# Altium project two_ax_PCB.PrjPcb (part 1 of 2)
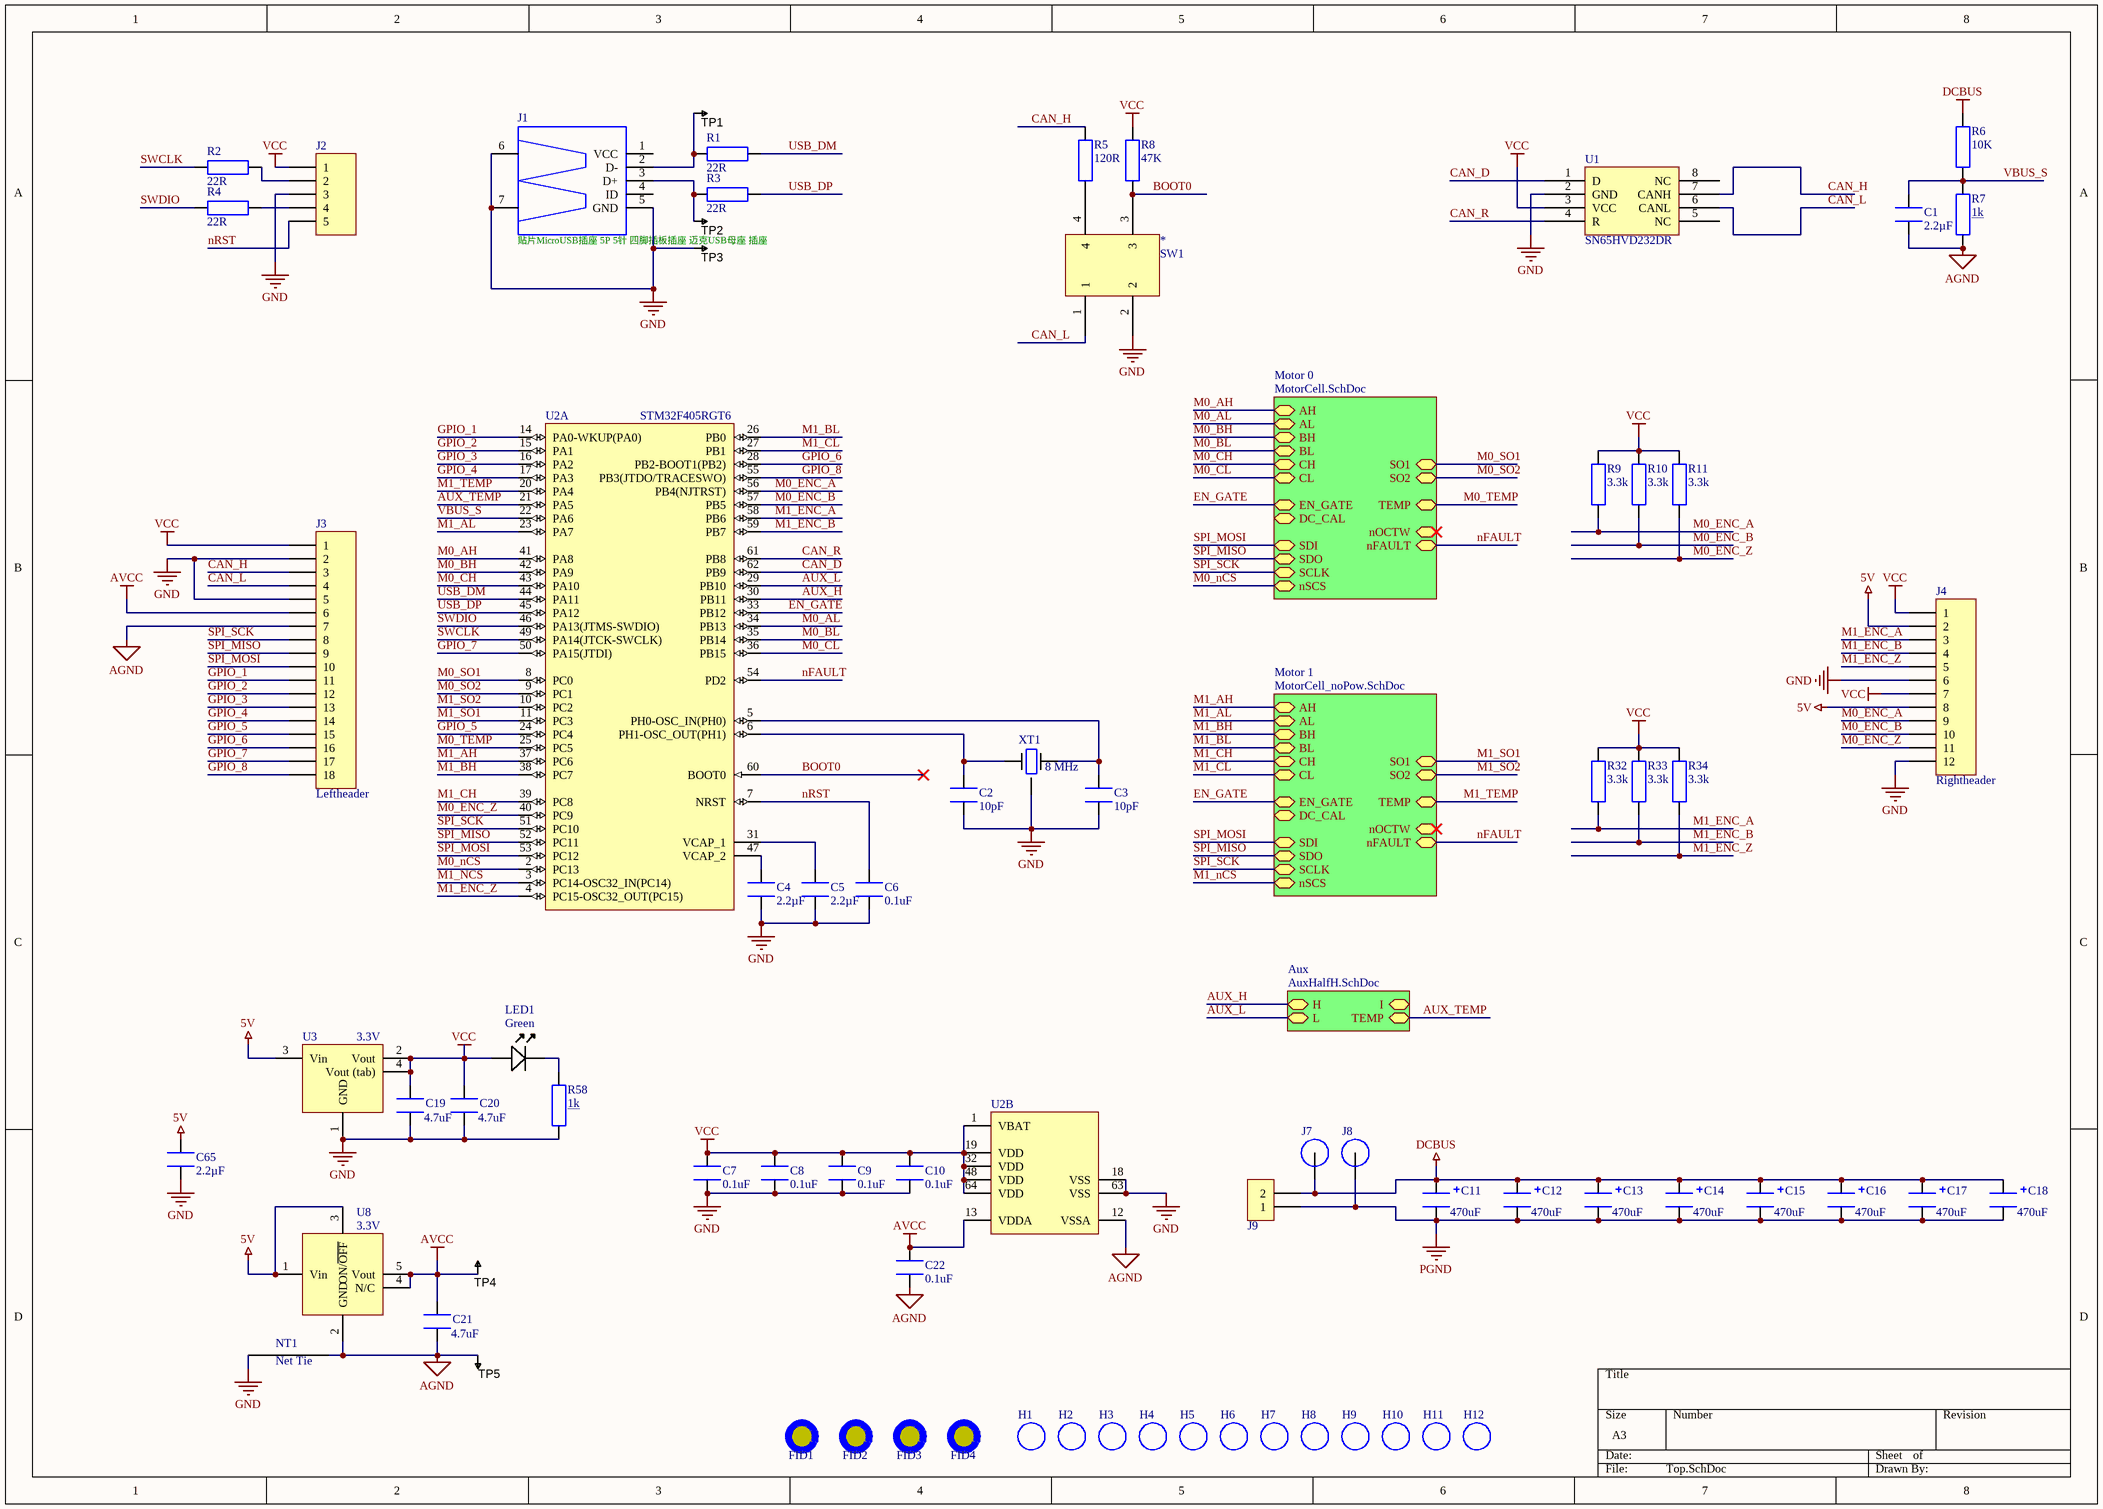
[diagram p0: Top.SchDoc]
3 sheets, 156 parts. Net scope: hierarchical (ports join the sheet entries above them; power ports are global).
Board file: PCB.PcbDoc
Sheets:
  Top.SchDoc
    Motor 0 = MotorCell.SchDoc
    Aux = AuxHalfH.SchDoc

## Sheet Top.SchDoc
size A3; SheetNumber: 1

### Parts
*  SW1  [switch_2]
C1  2.2µF  [CAPC1608X09L]
C2  10pF  [CAPC1608X09L]
C3  10pF  [CAPC1608X09L]
C4  2.2µF  [CAPC1608X09L]
C5  2.2µF  [CAPC1608X09L]
C6  0.1uF  [CAPC1608X09L]
C7  0.1uF  [CAPC1608X09L]
C8  0.1uF  [CAPC1608X09L]
C9  0.1uF  [CAPC1608X09L]
C10  0.1uF  [CAPC1608X09L]
C11  470uF  [CAP_ELEC_SIZE_G]
C12  470uF  [CAP_ELEC_SIZE_G]
C13  470uF  [CAP_ELEC_SIZE_G]
C14  470uF  [CAP_ELEC_SIZE_G]
C15  470uF  [CAP_ELEC_SIZE_G]
C16  470uF  [CAP_ELEC_SIZE_G]
C17  470uF  [CAP_ELEC_SIZE_G]
C18  470uF  [CAP_ELEC_SIZE_G]
C19  4.7uF  [CAPC2012X09N]
C20  4.7uF  [CAPC2012X09N]
C21  4.7uF  [CAPC2012X09N]
C22  0.1uF  [CAPC1608X09L]
C65  2.2µF  [CAPC1608X09L]
FID1  FIDUCIAL  [FIDUCIAL]  (value not drawn)
FID2  FIDUCIAL  [FIDUCIAL]  (value not drawn)
FID3  FIDUCIAL  [FIDUCIAL]  (value not drawn)
FID4  FIDUCIAL  [FIDUCIAL]  (value not drawn)
H1  (no value)  [M3 Hole]
H2  (no value)  [M3 Hole]
H3  (no value)  [M3 Hole]
H4  (no value)  [M3 Hole]
H5  (no value)  [M3 Hole]
H6  (no value)  [M3 Hole]
H7  (no value)  [M3 Hole]
H8  (no value)  [M3 Hole]
H9  (no value)  [M3 Hole]
H10  (no value)  [M3 Hole]
H11  (no value)  [M3 Hole]
H12  (no value)  [M3 Hole]
J1  贴片MicroUSB插座 5P 5针 四脚插板插座 迈克USB母座 插座  [Micro_USB]
J2  (no value)  [HDR1X5]
J3  Leftheader  [HDR1X18]
J4  Rightheader  [HDR1X12]
J7  (no value)  [M3 Spade Hole]
J8  (no value)  [M3 Spade Hole]
J9  1868076  [1868076]  (value not drawn)
LED1  Green  [LED-0603-GREEN]
NT1  (no value)  [NetTie_2mm]  (net tie, no BOM)
R1  22R  [RESC1608X55N]
R2  22R  [RESC1608X55N]
R3  22R  [RESC1608X55N]
R4  22R  [RESC1608X55N]
R5  120R  [RESC1608X55N]
R6  10K  [RESC1608X55N]
R7  1k  [RESC1608X55N]
R8  47K  [RESC1608X55N]
R9  3.3k  [RESC1608X55N]
R10  3.3k  [RESC1608X55N]
R11  3.3k  [RESC1608X55N]
R32  3.3k  [RESC1608X55N]
R33  3.3k  [RESC1608X55N]
R34  3.3k  [RESC1608X55N]
R58  1k  [RESC1608X55N]
TP1  TESTPOINT  [TP-R60]  (value not drawn)  (no BOM)
TP2  TESTPOINT  [TP-R60]  (value not drawn)  (no BOM)
TP3  TESTPOINT  [TP-R60]  (value not drawn)  (no BOM)
TP4  TESTPOINT  [TP-R30]  (value not drawn)  (no BOM)
TP5  TESTPOINT  [TP-R30]  (value not drawn)  (no BOM)
U1  Manufacturer Part Number: SN65HVD232DR  [SOIC127P600X175-8N]  (hidden comment: SN65HVD232D)
U2  (no value)  [STM-LQFP64_N]  (parts A,B of 2)
U3  3.3V  [SOT223]
U8  3.3V  [SOT23-5]
XT1  8 MHz  [DFN220P320X110-4N]

### Sub-sheets
Aux = AuxHalfH.SchDoc: H, L, I, TEMP
Motor 0 = MotorCell.SchDoc: nFAULT, nOCTW, EN_GATE, DC_CAL, SDI, SDO, SCLK, nSCS, SO1, SO2, AH, AL, BH, BL, CH, CL, TEMP
Motor 1 = MotorCell_noPow.SchDoc (file not in this document): nFAULT, nOCTW, EN_GATE, DC_CAL, SDI, SDO, SCLK, nSCS, SO1, SO2, AH, AL, BH, BL, CH, CL, TEMP

### Nets
5V: C65.2 J4.2 J4.8 U3.3(Vin) U8.1(Vin) U8.3(ON/~{OFF})
AGND: C1.1 C21.1 C22.2 J3.7 NT1.2 R7.1 TP5.1 U2.12(VSSA) U8.2(GND)
AVCC: C21.2 C22.1 J3.6 TP4.1 U2.13(VDDA) U8.4(N/C) U8.5(Vout)
DCBUS: C11.1 C12.1 C13.1 C14.1 C15.1 C16.1 C17.1 C18.1 J7.1 J9.2 R6.2
GND: *.2 C2.2 C3.2 C4.1 C5.1 C6.1 C7.2 C8.2 C9.2 C10.2 C19.1 C20.1 C65.1 J1.5(GND) J1.6 J1.7 J2.3 J3.2 J3.5 J4.6 J4.12 NT1.1 R58.2 TP3.1 U1.2(GND) U2.18(VSS) U2.63(VSS) U3.1(GND) XT1.G
PGND: C11.2 C12.2 C13.2 C14.2 C15.2 C16.2 C17.2 C18.2 J8.1 J9.1
VCC: C7.1 C8.1 C9.1 C10.1 C19.2 C20.2 J2.1 J3.1 J4.1 J4.7 LED1.A R8.2 R9.2 R10.2 R11.2 R32.1 R33.1 R34.1 U1.3(VCC) U2.1(VBAT) U2.19(VDD) U2.32(VDD) U2.48(VDD) U2.64(VDD) U3.2(Vout) U3.4(Vout_(tab))
AUX_H: U2.30(PB11) ; sheet Aux/H
AUX_L: U2.29(PB10) ; sheet Aux/L
AUX_TEMP: U2.21(PA5) ; sheet Aux/TEMP
BOOT0: *.3 R8.1 U2.60(BOOT0)  [project net BOOT0_1]
CAN_D: U1.1(D) U2.62(PB9)  [project net CAN_D_1]
CAN_H: J3.3 R5.2 U1.7(CANH)  [project net CAN_H_1]
CAN_L: *.1 J3.4 U1.6(CANL)  [project net CAN_L_1]
CAN_R: U1.4(R) U2.61(PB8)  [project net CAN_R_1]
EN_GATE: U2.33(PB12) ; sheet Motor 0/EN_GATE, sheet Motor 1/EN_GATE
GPIO_1: J3.11 U2.14(PA0-WKUP(PA0))  [project net GPIO_1_1]
GPIO_2: J3.12 U2.15(PA1)  [project net GPIO_2_1]
GPIO_3: J3.13 U2.16(PA2)  [project net GPIO_3_1]
GPIO_4: J3.14 U2.17(PA3)  [project net GPIO_4_1]
GPIO_5: J3.15 U2.24(PC4)  [project net GPIO_5_1]
GPIO_6: J3.16 U2.28(PB2-BOOT1(PB2))  [project net GPIO_6_1]
GPIO_7: J3.17 U2.50(PA15(JTDI))  [project net GPIO_7_1]
GPIO_8: J3.18 U2.55(PB3(JTDO/TRACESWO))  [project net GPIO_8_1]
M0_AH: U2.41(PA8) ; sheet Motor 0/AH
M0_AL: U2.34(PB13) ; sheet Motor 0/AL
M0_BH: U2.42(PA9) ; sheet Motor 0/BH
M0_BL: U2.35(PB14) ; sheet Motor 0/BL
M0_CH: U2.43(PA10) ; sheet Motor 0/CH
M0_CL: U2.36(PB15) ; sheet Motor 0/CL
M0_ENC_A: J4.9 R9.1 U2.56(PB4(NJTRST))  [project net M0_ENC_A_1]
M0_ENC_B: J4.10 R10.1 U2.57(PB5)  [project net M0_ENC_B_1]
M0_ENC_Z: J4.11 R11.1 U2.40(PC9)  [project net M0_ENC_Z_1]
M0_nCS: U2.2(PC13) ; sheet Motor 0/nSCS
M0_SO1: U2.8(PC0) ; sheet Motor 0/SO1
M0_SO2: U2.9(PC1) ; sheet Motor 0/SO2
M0_TEMP: U2.25(PC5) ; sheet Motor 0/TEMP
M1_AH: U2.37(PC6) ; sheet Motor 1/AH
M1_AL: U2.23(PA7) ; sheet Motor 1/AL
M1_BH: U2.38(PC7) ; sheet Motor 1/BH
M1_BL: U2.26(PB0) ; sheet Motor 1/BL
M1_CH: U2.39(PC8) ; sheet Motor 1/CH
M1_CL: U2.27(PB1) ; sheet Motor 1/CL
M1_ENC_A: J4.3 R32.2 U2.58(PB6)  [project net M1_ENC_A_1]
M1_ENC_B: J4.4 R33.2 U2.59(PB7)  [project net M1_ENC_B_1]
M1_ENC_Z: J4.5 R34.2 U2.4(PC15-OSC32_OUT(PC15))  [project net M1_ENC_Z_1]
M1_nCS: U2.3(PC14-OSC32_IN(PC14)) ; sheet Motor 1/nSCS
M1_SO1: U2.11(PC3) ; sheet Motor 1/SO1
M1_SO2: U2.10(PC2) ; sheet Motor 1/SO2
M1_TEMP: U2.20(PA4) ; sheet Motor 1/TEMP
nFAULT: U2.54(PD2) ; sheet Motor 0/nFAULT, sheet Motor 1/nFAULT
nRST: C6.2 J2.5 U2.7(NRST)  [project net nRST_1]
SPI_MISO: J3.9 U2.52(PC11) ; sheet Motor 0/SDO, sheet Motor 1/SDO
SPI_MOSI: J3.10 U2.53(PC12) ; sheet Motor 0/SDI, sheet Motor 1/SDI
SPI_SCK: J3.8 U2.51(PC10) ; sheet Motor 0/SCLK, sheet Motor 1/SCLK
SWCLK: R2.2 U2.49(PA14(JTCK-SWCLK))  [project net SWCLK_1]
SWDIO: R4.2 U2.46(PA13(JTMS-SWDIO))  [project net SWDIO_1]
USB_DM: R1.1 U2.44(PA11)  [project net USB_DM_1]
USB_DP: R3.1 U2.45(PA12)  [project net USB_DP_1]
VBUS_S: C1.2 R6.1 R7.2 U2.22(PA6)  [project net VBUS_S_1]
Net*_4: *.4 R5.1
NetC2_1: C2.1 U2.6(PH1-OSC_OUT(PH1)) XT1.1
NetC3_1: C3.1 U2.5(PH0-OSC_IN(PH0)) XT1.3
NetC4_2: C4.2 U2.47(VCAP_2)
NetC5_2: C5.2 U2.31(VCAP_1)
NetJ1_2: J1.2(D-) R1.2 TP1.1
NetJ1_3: J1.3(D+) R3.2 TP2.1
NetJ2_2: J2.2 R2.1
NetJ2_4: J2.4 R4.1
NetLED1_K: LED1.K R58.1

Not connected (* = marked no-connect by the designer): J1 1(VCC) 4(ID); U1 5(NC) 8(NC)

### Notes on the sheet
- (in symbol NetTie_2mm) Net Tie

### Library data of the parts
* = Switch_2
C1 C4 C5 C65 = GRM188R61C225KE15D: CAP CER 2.2UF 16V X5R 0603; Manufacturer: Murata Electronics North America; Tolerance: ?0%; Supplier 1: Digi-Key; Supplier Part Number 1: 490-3296-1-ND; Manufacturer Part Number: GRM188R61C225KE15D; RoHS: RoHS Compliant; Category: Capacitors; Stock 1: 1255740; Pricing 1: 1=0.12, 10=0.08, 50=0.046, 100=0.038, 250=0.032, 500=0.0268, 1000=0.022 (USD); Packaging: Cut Tape (CT); Capacitance: 2.2µF; Voltage - Rated: 16V; Temperature Coefficient: X5R; Mounting Type: Surface Mount, MLCC; Operating Temperature: -55°C ~ 85°C; Applications: General Purpose; Ratings: -; Package / Case: 0603 (1608 Metric); Size / Dimension: 0.063" L x 0.031" W (1.60mm x 0.80mm); Height - Seated (Max): -; Thickness (Max): 0.035" (0.90mm); Lead Spacing: -; Features: -; Lead Style: -; ComponentLink1URL: http://www.murata.com/~/media/webrenewal/support/library/catalog/products/capacitor/mlcc/c02e.pdf; ComponentLink1Description: http://www.murata.com/~/media/webrenewal/support/library/catalog/products/capacitor/mlcc/c02e.pdf
C2 C3 = GRM1885C1H100JA01D: CAP CER 10PF 50V NP0 0603; Manufacturer: Murata Electronics North America; Tolerance: ?%; Temperature Coefficient: C0G, NP0; Supplier 1: Digi-Key; Supplier Part Number 1: 490-1403-1-ND; Manufacturer Part Number: GRM1885C1H100JA01D; RoHS: RoHS Compliant; Category: Capacitors; Stock 1: 450321; Pricing 1: 1=0.1, 10=0.041, 50=0.0222, 100=0.0187, 250=0.01532, 500=0.0131, 1000=0.0102 (USD); Packaging: Cut Tape (CT); Capacitance: 10pF; Voltage - Rated: 50V; Mounting Type: Surface Mount, MLCC; Operating Temperature: -55°C ~ 125°C; Applications: General Purpose; Ratings: -; Package / Case: 0603 (1608 Metric); Size / Dimension: 0.063" L x 0.031" W (1.60mm x 0.80mm); Height - Seated (Max): -; Thickness (Max): 0.035" (0.90mm); Lead Spacing: -; Features: -; Lead Style: -; ComponentLink1URL: http://www.murata.com/~/media/webrenewal/support/library/catalog/products/capacitor/mlcc/c02e.pdf; ComponentLink1Description: http://www.murata.com/~/media/webrenewal/support/library/catalog/products/capacitor/mlcc/c02e.pdf
C6-C10 C22 = GRM188R71H104KA93D: CAP CER 0.1UF 50V X7R 0603; Manufacturer: Murata Electronics North America; Tolerance: ?0%; Supplier 1: Digi-Key; Supplier Part Number 1: 490-1519-2-ND; Manufacturer Part Number: GRM188R71H104KA93D; RoHS: RoHS Compliant; Category: Capacitors; Pricing 1: 4000=0.01822, 8000=0.01663, 12000=0.01584 (USD); Packaging: Tape & Reel (TR); Capacitance: 0.1uF; Voltage - Rated: 50V; Temperature Coefficient: X7R; Mounting Type: Surface Mount, MLCC; Operating Temperature: -55°C ~ 125°C; Applications: General Purpose; Ratings: -; Package / Case: 0603 (1608 Metric); Size / Dimension: 0.063" L x 0.032" W (1.60mm x 0.80mm); Height - Seated (Max): -; Thickness (Max): 0.035" (0.90mm); Lead Spacing: -; Features: -; Lead Style: -; ComponentLink1URL: http://www.murata.com/~/media/webrenewal/support/library/catalog/products/capacitor/mlcc/c02e.ashx?la=en-us; ComponentLink1Description: http://www.murata.com/~/media/webrenewal/support/library/catalog/products/capacitor/mlcc/c02e.ashx?la=en-us; Stock: 19812000; Part Status: Active; Supplier 2: Digi-Key; Supplier Part Number 2: 490-1519-1-ND; Pricing 2: 1=0.12, 10=0.084, 100=0.0396, 500=0.02778, 1000=0.023 (USD)
C11-C18 = EEEFP1E471AP: CAP, FP Series, 470 µF, 25 V, Radial Can - SMD, 10 mm; Manufacturer: Panasonic Electronic Components; Manufacturer Part Number: EEE-FP1E471AP; Tolerance: ?0%; ESR (Equivalent Series Resistance): 60 mOhm @ 100kHz; Lifetime @ Temp.: 2000 Hrs @ 105°C; Polarization: Polar; Ripple Current - Low Frequency: 773.5mA @ 120Hz; Ripple Current - High Frequency: 1.19A @ 100kHz; Surface Mount Land Size: 0.406" L x 0.406" W (10.30mm x 10.30mm); Value: 470uF; Supplier 1: Digi-Key; Supplier Part Number 1: PCE4440TR-ND; RoHS: RoHS Compliant; Category: Capacitors; Stock: 8000; Pricing 1: 500=0.3571, 1000=0.30072, 2500=0.28192, 5000=0.26313, 12500=0.24997, 25000=0.24434 (USD); Packaging: Tape & Reel (TR); Part Status: Active; Operating Temperature: -55°C ~ 105°C; Applications: Automotive; Lead Spacing: -; Size / Dimension: 0.394" Dia (10.00mm); Height - Seated (Max): 0.402" (10.20mm); Mounting Type: Surface Mount; Package / Case: Radial, Can - SMD; ComponentLink1URL: http://industrial.panasonic.com/www-cgi/jvcr13pz.cgi?E+PZ+3+ABA0114+EEEFP1E471AP+7+WW; ComponentLink1Description: http://industrial.panasonic.com/www-cgi/jvcr13pz.cgi?E+PZ+3+ABA0114+EEEFP1E471AP+7+WW; Supplier 2: Digi-Key; Supplier Part Number 2: PCE4440CT-ND; Pricing 2: 1=0.92, 10=0.702, 100=0.5025 (USD)
C19-C21 = GRM219R6YA475KA73D: CAP CER 4.7UF 35V X5R 0805; Manufacturer: Murata Electronics North America; Tolerance: ?0%; Supplier 1: Digi-Key; Supplier Part Number 1: 490-7208-2-ND; RoHS: RoHS Compliant; Category: Capacitors; Pricing 1: 4000=0.05126, 8000=0.0487, 12000=0.04613 (USD); Packaging: Tape & Reel (TR); Part Status: Active; Voltage - Rated: 35V; Temperature Coefficient: X5R; Operating Temperature: -55°C ~ 85°C; Features: Derating Recommended; Ratings: -; Applications: General Purpose; Mounting Type: Surface Mount, MLCC; Package / Case: 0805 (2012 Metric); Size / Dimension: 0.079" L x 0.049" W (2.01mm x 1.25mm); Height - Seated (Max): -; Thickness (Max): 0.037" (0.95mm); Lead Spacing: -; Lead Style: -; ComponentLink1URL: http://www.murata.com/~/media/webrenewal/support/library/catalog/products/capacitor/mlcc/c02e.ashx?la=en-us; ComponentLink1Description: http://www.murata.com/~/media/webrenewal/support/library/catalog/products/capacitor/mlcc/c02e.ashx?la=en-us; Supplier 2: Digi-Key; Supplier Part Number 2: 490-7208-1-ND; Pricing 2: 1=0.26, 10=0.177, 100=0.1002, 500=0.07076, 1000=0.06191 (USD); Value: 4.7uF; Stock: 152000; Manufacturer Part Number: GRM219R6YA475KA73D
FID1-FID4 = FIDUCIAL: 1mm Fiducial with 2mm soldermask, 3mm keepout
H1-H12 = M3 Hole: M3 Hole with no copper
J1 = USB_1_1
J2 = Header 5: Header, 5-Pin; LatestRevisionDate: 17-Jul-2002; LatestRevisionNote: Re-released for DXP Platform.; Publisher: Altium Limited
J3 = Header 18: Header, 18-Pin; LatestRevisionDate: 17-Jul-2002; LatestRevisionNote: Re-released for DXP Platform.; Publisher: Altium Limited
J4 = Header 12: Header, 12-Pin; LatestRevisionDate: 17-Jul-2002; LatestRevisionNote: Re-released for DXP Platform.; Publisher: Altium Limited
J7 J8 = M3 Spade Terminal
J9 = 1868076: CONN TERM BLOCK 2POS 7.62MM; Manufacturer: Phoenix Contact; Number of Levels: 1; Positions Per Level: 2; Pitch: 0.300" (7.62mm); Mating Orientation: Horizontal with Board; Current: 30A; Voltage: 300V; Wire Gauge: 10-30 AWG; Wire Termination: Screw - Rising Cage Clamp; Torque - Screw: 0.5-0.6 Nm (4.4-5.3 Lb-In); Screw Thread: M3; Supplier 1: Digi-Key; Supplier Part Number 1: 277-5840-ND; RoHS: RoHS Compliant; Category: Connectors, Interconnects; Stock: 2175; Pricing 1: 1=1.56, 10=1.517, 50=1.4178, 100=1.3044, 250=1.20512, 500=1.14842, 1000=1.0564 (USD); Packaging: Bulk; Part Status: Active; Mounting Type: Through Hole; Features: Interlocking (Side); Color: Green; Operating Temperature: -; Housing Material: Polyamide (PA), Nylon; Contact Material - Plating: -; Clamp Material - Plating: -; Screw Material - Plating: -; ComponentLink1URL: http://media.digikey.com/PDF/Data%20Sheets/Phoenix%20Contact%20PDFs/1868076.pdf; ComponentLink1Description: http://media.digikey.com/PDF/Data%20Sheets/Phoenix%20Contact%20PDFs/1868076.pdf
LED1 = LTST-C190KGKT: LED GREEN CLEAR 0603 SMD; Manufacturer: Lite-On Inc.; Lens Color: Colorless; Millicandela Rating: 35mcd; Lens Style/Size: Rectangle with Flat Top, 1.10mm x 0.80mm; Voltage - Forward (Vf) (Typ): 2V; Current - Test: 20mA; Viewing Angle: 130?; Wavelength - Dominant: 571nm; Wavelength - Peak: 574nm; Supplier 1: Digi-Key; Supplier Part Number 1: 160-1435-1-ND; RoHS: RoHS Compliant; Category: Optoelectronics; Stock: 922756; Pricing 1: 1=0.27, 10=0.196, 25=0.1448, 100=0.1034, 250=0.07032, 500=0.06204, 1000=0.0486 (USD); Packaging: Cut Tape (CT); Part Status: Active; Color: Green; Lens Transparency: Clear; Mounting Type: Surface Mount; Features: -; Package / Case: 0603 (1608 Metric); Size / Dimension: 1.60mm L x 0.80mm W; Height (Max): 0.80mm; ComponentLink1URL: http://optoelectronics.liteon.com/upload/download/DS22-2000-074/S_110_LTST-C190KGKT.pdf; ComponentLink1Description: http://optoelectronics.liteon.com/upload/download/DS22-2000-074/S_110_LTST-C190KGKT.pdf; Manufacturer Part Number: LTST-C190KGKT
NT1 = NetTie_2mm
R1-R4 = RC0603FR-0722RL: RES SMD 22 OHM 1% 1/10W 0603; Manufacturer: Yageo; Resistance (Ohms): 22; Tolerance: ?%; Power (Watts): 0.1W, 1/10W; Temperature Coefficient: ?00ppm/°C; Supplier 1: Digi-Key; Supplier Part Number 1: 311-22.0HRCT-ND; Manufacturer Part Number: RC0603FR-0722RL; RoHS: RoHS Compliant; Category: Resistors; Stock 1: 575303; Pricing 1: 1=0.1, 10=0.014, 25=0.01, 100=0.0057, 250=0.00436, 500=0.00348, 1000=0.00257, 2500=0.00223 (USD); Packaging: Cut Tape (CT); Composition: Thick Film; Features: Moisture Resistant; Operating Temperature: -55°C ~ 155°C; Package / Case: 0603 (1608 Metric); Supplier Device Package: 0603; Size / Dimension: 0.063" L x 0.031" W (1.60mm x 0.80mm); Height: 0.022" (0.55mm); Number of Terminations: 2; ComponentLink1URL: http://www.yageo.com/documents/recent/PYu-RC_Group_51_RoHS_L_04.pdf; ComponentLink1Description: http://www.yageo.com/documents/recent/PYu-RC_Group_51_RoHS_L_04.pdf
R5 = RC0603FR-07120RL: RES SMD 120 OHM 1% 1/10W 0603; Manufacturer: Yageo; Resistance (Ohms): 120; Tolerance: ?%; Power (Watts): 0.1W, 1/10W; Temperature Coefficient: ?00ppm/°C; Supplier 1: Digi-Key; Supplier Part Number 1: 311-120HRCT-ND; Manufacturer Part Number: RC0603FR-07120RL; RoHS: RoHS Compliant; Category: Resistors; Stock 1: 1545282; Pricing 1: 1=0.1, 10=0.014, 25=0.01, 100=0.0057, 250=0.00436, 500=0.00348, 1000=0.00257, 2500=0.00223 (USD); Packaging: Cut Tape (CT); Composition: Thick Film; Features: Moisture Resistant; Operating Temperature: -55°C ~ 155°C; Package / Case: 0603 (1608 Metric); Supplier Device Package: 0603; Size / Dimension: 0.063" L x 0.031" W (1.60mm x 0.80mm); Height: 0.022" (0.55mm); Number of Terminations: 2; ComponentLink1URL: http://www.yageo.com/documents/recent/PYu-RC_Group_51_RoHS_L_04.pdf; ComponentLink1Description: http://www.yageo.com/documents/recent/PYu-RC_Group_51_RoHS_L_04.pdf
R6 = RC0603FR-0710KL: RES SMD 10K OHM 1% 1/10W 0603; Manufacturer: Yageo; Tolerance: ?%; Power (Watts): 0.1W, 1/10W; Temperature Coefficient: ?00ppm/°C; Supplier 1: Digi-Key; Supplier Part Number 1: 311-10.0KHRCT-ND; Manufacturer Part Number: RC0603FR-0710KL; RoHS: RoHS Compliant; Category: Resistors; Stock 1: 13504930; Pricing 1: 1=0.1, 10=0.014, 25=0.01, 100=0.0057, 250=0.00436, 500=0.00348, 1000=0.00257, 2500=0.00223 (USD); Packaging: Cut Tape (CT); Resistance (Ohms): 10k; Composition: Thick Film; Features: Moisture Resistant; Operating Temperature: -55°C ~ 155°C; Package / Case: 0603 (1608 Metric); Supplier Device Package: 0603; Size / Dimension: 0.063" L x 0.031" W (1.60mm x 0.80mm); Height: 0.022" (0.55mm); Number of Terminations: 2; ComponentLink1URL: http://www.yageo.com/documents/recent/PYu-RC_Group_51_RoHS_L_04.pdf; ComponentLink1Description: http://www.yageo.com/documents/recent/PYu-RC_Group_51_RoHS_L_04.pdf
R7 R58 = RC0603FR-071KL: RES SMD 1K OHM 1% 1/10W 0603; Manufacturer: Yageo; Tolerance: ?%; Power (Watts): 0.1W, 1/10W; Temperature Coefficient: ?00ppm/°C; Supplier 1: Digi-Key; Supplier Part Number 1: 311-1.00KHRCT-ND; RoHS: RoHS Compliant; Category: Resistors; Stock 1: 6734836; Pricing 1: 1=0.1, 10=0.014, 25=0.01, 100=0.0057, 250=0.00436, 500=0.00348, 1000=0.00257, 2500=0.00223 (USD); Packaging: Cut Tape (CT); Composition: Thick Film; Features: Moisture Resistant; Operating Temperature: -55°C ~ 155°C; Package / Case: 0603 (1608 Metric); Supplier Device Package: 0603; Size / Dimension: 0.063" L x 0.031" W (1.60mm x 0.80mm); Height: 0.022" (0.55mm); Number of Terminations: 2; ComponentLink1URL: http://www.yageo.com/documents/recent/PYu-RC_Group_51_RoHS_L_04.pdf; ComponentLink1Description: http://www.yageo.com/documents/recent/PYu-RC_Group_51_RoHS_L_04.pdf; Manufacturer Part Number: RC0603FR-071KL; Resistance (Ohms): 1k
R8 = RC0603FR-0747KL: RES SMD 47K OHM 1% 1/10W 0603; Manufacturer: Yageo; Tolerance: ?%; Power (Watts): 0.1W, 1/10W; Temperature Coefficient: ?00ppm/°C; Supplier 1: Digi-Key; Supplier Part Number 1: 311-47.0KHRCT-ND; Manufacturer Part Number: RC0603FR-0747KL; RoHS: RoHS Compliant; Category: Resistors; Stock 1: 930868; Pricing 1: 1=0.1, 10=0.014, 25=0.01, 100=0.0057, 250=0.00436, 500=0.00348, 1000=0.00257, 2500=0.00223 (USD); Packaging: Cut Tape (CT); Resistance (Ohms): 47k; Composition: Thick Film; Features: Moisture Resistant; Operating Temperature: -55°C ~ 155°C; Package / Case: 0603 (1608 Metric); Supplier Device Package: 0603; Size / Dimension: 0.063" L x 0.031" W (1.60mm x 0.80mm); Height: 0.022" (0.55mm); Number of Terminations: 2; ComponentLink1URL: http://www.yageo.com/documents/recent/PYu-RC_Group_51_RoHS_L_04.pdf; ComponentLink1Description: http://www.yageo.com/documents/recent/PYu-RC_Group_51_RoHS_L_04.pdf
R9-R11 R32-R34 = RC0603FR-073K3L: RES SMD 3.3K OHM 1% 1/10W 0603; Manufacturer: Yageo; Tolerance: ?%; Power (Watts): 0.1W, 1/10W; Temperature Coefficient: ?00ppm/°C; Supplier 1: Digi-Key; Supplier Part Number 1: 311-3.30KHRCT-ND; RoHS: RoHS Compliant; Category: Resistors; Stock 1: 420019; Pricing 1: 1=0.1, 10=0.014, 25=0.01, 100=0.0057, 250=0.00436, 500=0.00348, 1000=0.00257, 2500=0.00223 (USD); Packaging: Cut Tape (CT); Composition: Thick Film; Features: Moisture Resistant; Operating Temperature: -55°C ~ 155°C; Package / Case: 0603 (1608 Metric); Supplier Device Package: 0603; Size / Dimension: 0.063" L x 0.031" W (1.60mm x 0.80mm); Height: 0.022" (0.55mm); Number of Terminations: 2; ComponentLink1URL: http://www.yageo.com/documents/recent/PYu-RC_Group_51_RoHS_L_04.pdf; ComponentLink1Description: http://www.yageo.com/documents/recent/PYu-RC_Group_51_RoHS_L_04.pdf; Manufacturer Part Number: RC0603FR-073K3L; Resistance (Ohms): 3.3k
TP1-TP5 = TESTPOINT: SMD test pin
U1 = SN65HVD232D: Manufacturer: Texas Instruments; Protocol: CAN; Number of Drivers/Receivers: 1/1; Duplex: Half; Data Rate: 1Mbps; Voltage - Supply: 3 V ~ 3.6 V; Supplier 1: Digi-Key; Supplier Part Number 1: 296-26344-2-ND; RoHS: RoHS Compliant; Category: Integrated Circuits (ICs); Stock: 5000; Pricing 1: 2500=0.84375 (USD); Packaging: Tape & Reel (TR); Part Status: Active; Type: Transceiver; Operating Temperature: -40°C ~ 85°C; Mounting Type: Surface Mount; Package / Case: 8-SOIC (0.154", 3.90mm Width); Supplier Device Package: 8-SOIC; ComponentLink1URL: http://www.ti.com/lit/ds/symlink/sn65hvd230.pdf; ComponentLink1Description: http://www.ti.com/lit/ds/symlink/sn65hvd230.pdf; Supplier 2: Digi-Key; Supplier Part Number 2: 296-26344-1-ND; Pricing 2: 1=2.05, 10=1.842, 100=1.4809, 500=1.21668, 1000=1.00811 (USD)
U2 = STM32F405RGT6: ARM Cortex-M4 32-bit MCU+FPU, 210 DMIPS, 1024 kB Flash, 192 kB Internal RAM, 51 I/Os, 64-pin LQFP, -40 to 85 degC, Tray; Manufacturer: STMicroelectronics; D/A Converter: 2x12-bit; FLASH Size (Prog) (kB): 1024; I/Os (High Current): 51; Internal RAM Size (kB): 192; Operating Frequency(F) (Processor speed) (MHz): 168; Supply Voltage(Vcc) max (V): 3.6; Supply Voltage(Vcc) min (V): 1.8; DatasheetVersion: Rev. 4; PackageVersion: Rev. 4, 06/2013; PackageReference: LQFP64; PackageDescription: 64-Pin Low Profile Quad Flat Package, 10 x 10 mm Body, 0.5 mm Pitch; Supplier 1: Digi-Key; Supplier Part Number 1: 497-11767-ND; Supplier 2: Farnell; Supplier Part Number 2: 2064363; Supplier 3: Newark; Supplier Part Number 3: 73T2329; Supplier 4: Mouser; Supplier Part Number 4: 511-STM32F405RGT6; Core: ARM Cortex-M4; Packing: Tray; Mounting Technology: Surface Mount; PartNumber: STM32F405RGT6; ComponentLink1Description: Manufacturer URL; ComponentLink1URL: http://www.st.com/web/en/home.html; ComponentLink2Description: Datasheet; ComponentLink2URL: http://www.st.com/st-web-ui/static/active/en/resource/technical/document/datasheet/DM00037051.pdf; ComponentLink3Description: Package Specification; ComponentLink3URL: http://www.st.com/st-web-ui/static/active/en/resource/technical/document/datasheet/DM00037051.pdf
U3 = AZ1117EH-3.3TRG1: IC REG LDO 3.3V 1A SOT223; Manufacturer: Diodes Incorporated; Regulator Topology: Positive Fixed; Voltage - Dropout (Typical): 1.1V @ 1A; Voltage - Input: Up to 13V; Supplier 1: Digi-Key; Supplier Part Number 1: AZ1117EH-3.3TRG1DICT-ND; RoHS: RoHS Compliant; Category: Integrated Circuits (ICs); Stock 1: 22748; Pricing 1: 1=0.43, 10=0.321, 100=0.1815, 500=0.12022, 1000=0.09216 (USD); Packaging: Cut Tape (CT); Part Status: Active; Voltage - Output: 3.3V; Current - Output: 1A; Current - Limit (Min): -; Operating Temperature: -40°C ~ 125°C; Mounting Type: Surface Mount; Package / Case: TO-261-4, TO-261AA; Supplier Device Package: SOT-223; ComponentLink1URL: http://www.diodes.com/assets/Datasheets/AZ1117E.pdf; ComponentLink1Description: http://www.diodes.com/assets/Datasheets/AZ1117E.pdf
U8 = LP5907MFX-3.3/NOPB: IC REG LDO 3.3V 0.25A SOT23-5; Manufacturer: Texas Instruments; Regulator Topology: Positive Fixed; Current - Output: 250mA; Voltage - Input: Up to 5.5V; Supplier 1: Digi-Key; Supplier Part Number 1: 296-38557-1-ND; RoHS: RoHS Compliant; Category: Integrated Circuits (ICs); Stock 1: 39845; Pricing 1: 1=0.57, 10=0.487, 100=0.3634, 500=0.28552, 1000=0.22063 (USD); Packaging: Cut Tape (CT); Part Status: Active; Voltage - Output: 3.3V; Voltage - Dropout (Typical): -; Current - Limit (Min): -; Operating Temperature: -40°C ~ 125°C; Mounting Type: Surface Mount; Package / Case: SC-74A, SOT-753; Supplier Device Package: SOT-23; ComponentLink1URL: http://www.ti.com/lit/ds/symlink/lp5907.pdf; ComponentLink1Description: http://www.ti.com/lit/ds/symlink/lp5907.pdf
XT1 = ABM3B-8.000MHZ-10-1-U-T: Crystal 8MHz ?0ppm 10pF 200 Ohm -10°C ~ 60°C Surface Mount 4-SMD, No Lead (DFN, LCC); Manufacturer: Abracon LLC; Operating Mode: Fundamental; Value: 8 MHz; Supplier 1: Digi-Key; Supplier Part Number 1: 535-9721-1-ND; RoHS: RoHS Compliant; Category: Crystals, Oscillators, Resonators; Stock: 35437; Pricing 1: 1=0.69, 10=0.578, 50=0.5198, 100=0.462, 500=0.4389 (USD); Packaging: Cut Tape (CT); Part Status: Active; Type: MHz Crystal; Frequency Stability: ?0ppm; Frequency Tolerance: ?0ppm; Load Capacitance: 10pF; Operating Temperature: -10°C ~ 60°C; Ratings: -; Mounting Type: Surface Mount; Package / Case: 4-SMD, No Lead; Size / Dimension: 0.197" L x 0.126" W (5.00mm x 3.20mm); Height - Seated (Max): 0.043" (1.10mm); ComponentLink1URL: http://www.abracon.com/Resonators/abm3b.pdf; ComponentLink1Description: http://www.abracon.com/Resonators/abm3b.pdf; Supplier 2: Digi-Key; Supplier Part Number 2: 535-9721-2-ND; Pricing 2: 1000=0.336, 3000=0.315, 5000=0.3045, 10000=0.294 (USD); Manufacturer Part Number: ABM3B-8.000MHZ-10-1-U-T

## Sheet MotorCell.SchDoc
size A3; SheetNumber: 2
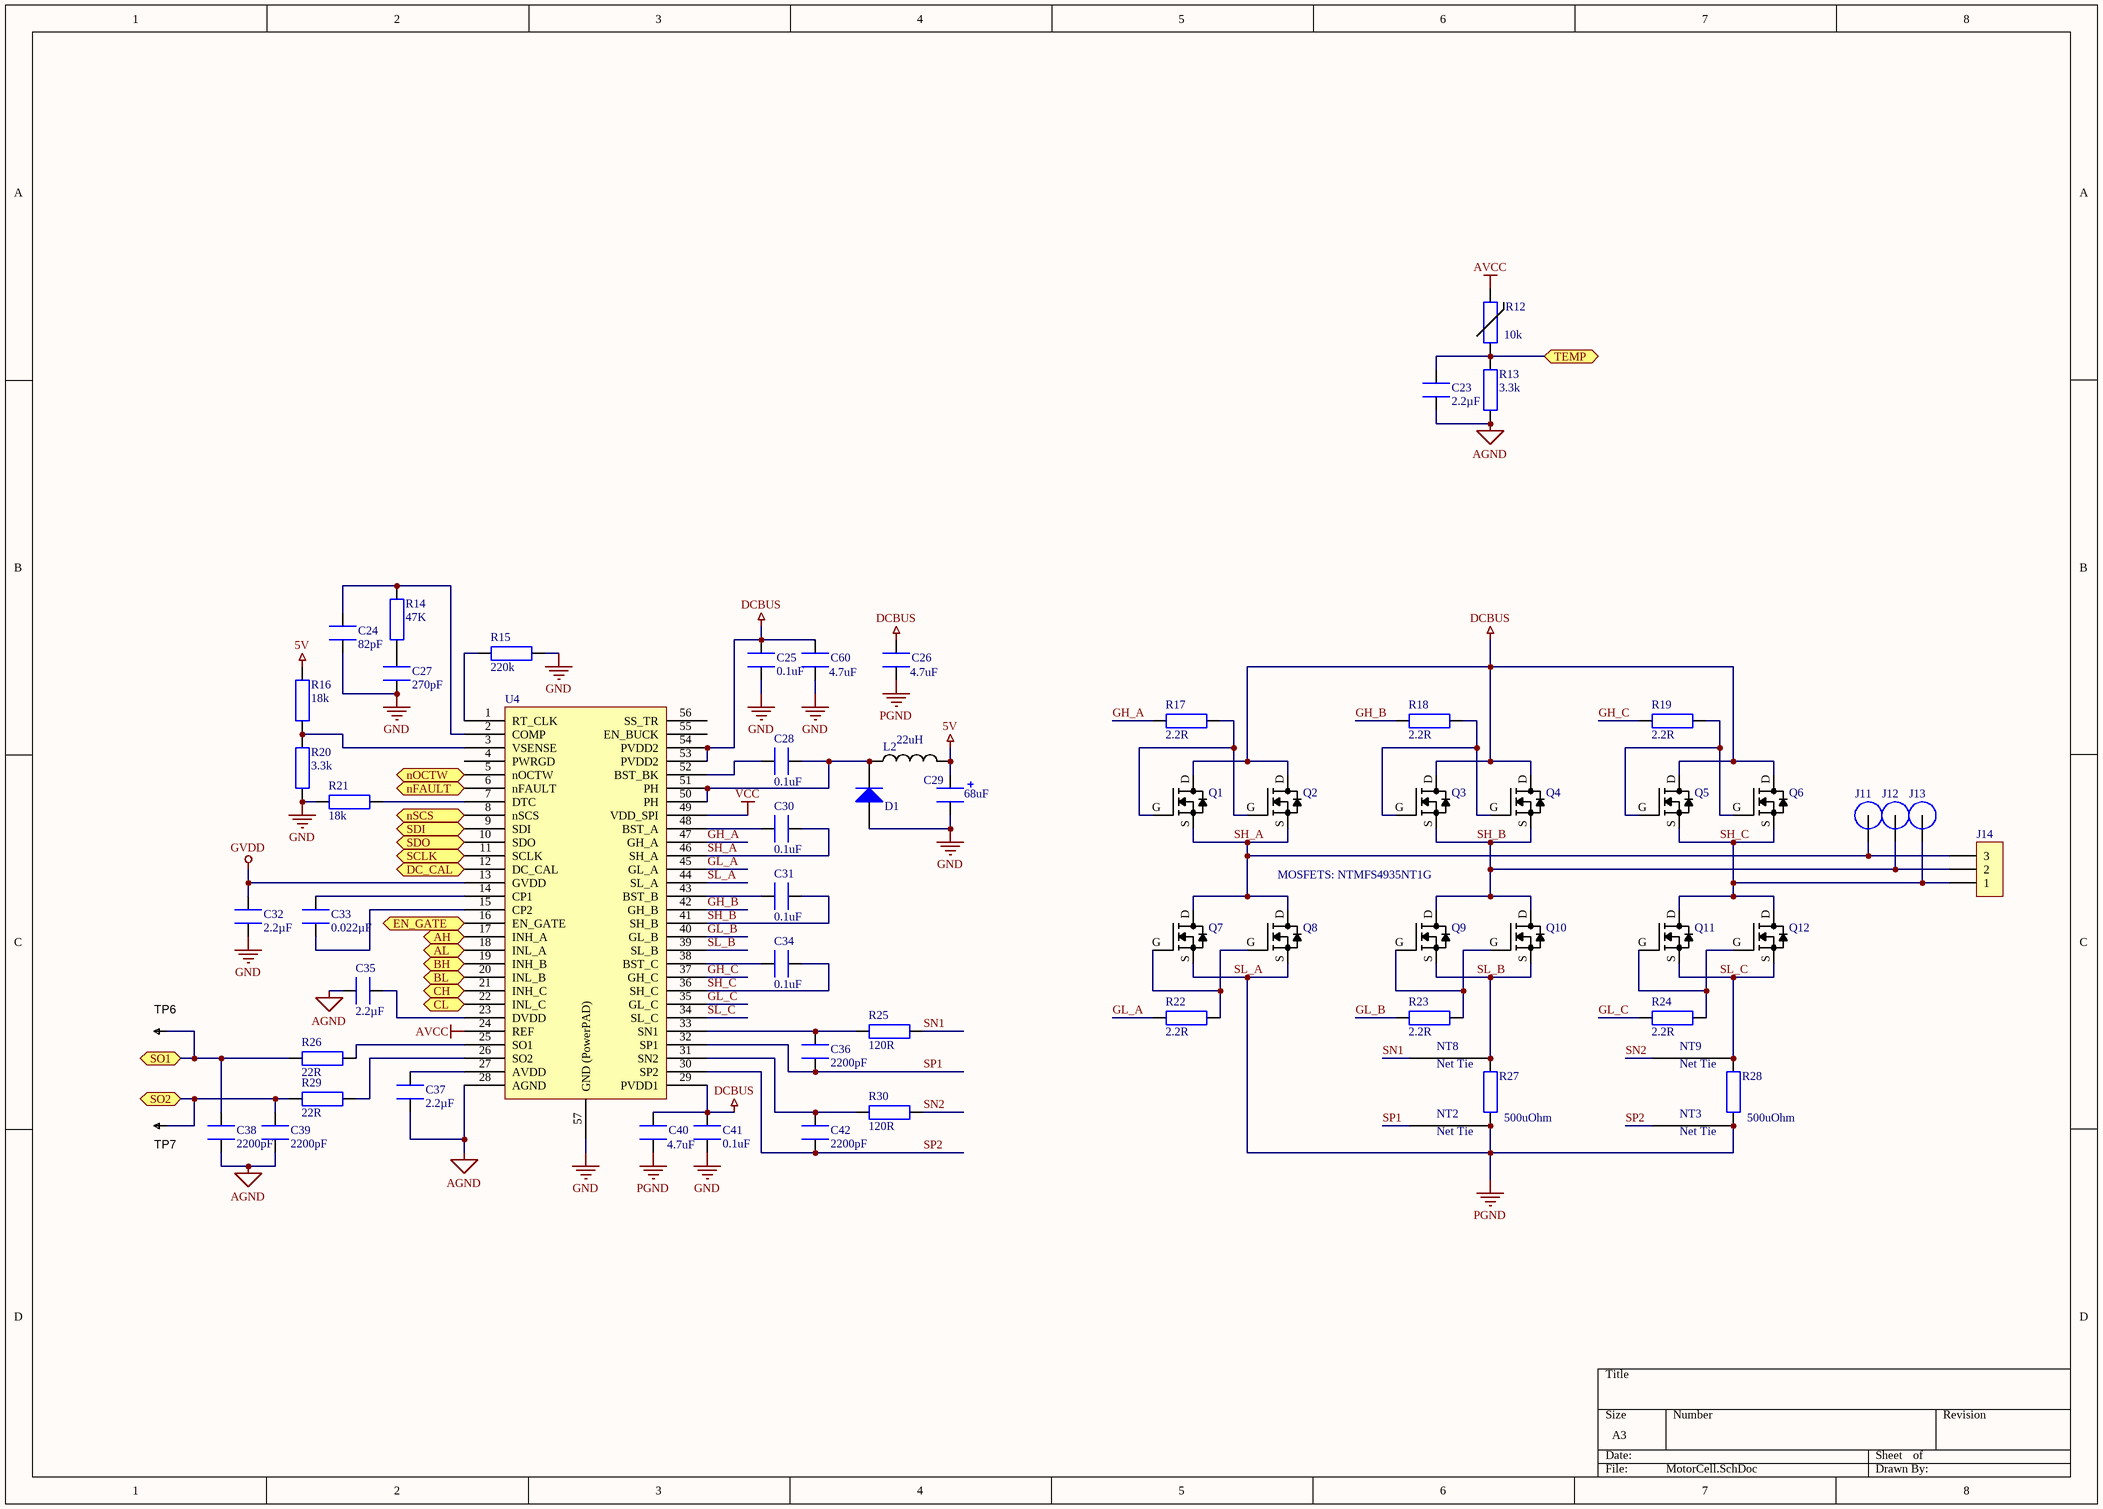
[diagram p1: MotorCell.SchDoc]

### Parts
C23  2.2µF  [CAPC1608X09L]
C24  82pF  [CAPC1608X09L]
C25  0.1uF  [CAPC1608X09L]
C26  4.7uF  [CAPC2012X09N]
C27  270pF  [CAPC1608X09L]
C28  0.1uF  [CAPC1608X09L]
C29  68uF  [CAPCP6032X28N]
C30  0.1uF  [CAPC1608X09L]
C31  0.1uF  [CAPC1608X09L]
C32  2.2µF  [CAPC1608X09L]
C33  0.022µF  [CAPC1608X09L]
C34  0.1uF  [CAPC1608X09L]
C35  2.2µF  [CAPC1608X09L]
C36  2200pF  [CAPC1608X09L]
C37  2.2µF  [CAPC1608X09L]
C38  2200pF  [CAPC1608X09L]
C39  2200pF  [CAPC1608X09L]
C40  4.7uF  [CAPC2012X09N]
C41  0.1uF  [CAPC1608X09L]
C42  2200pF  [CAPC1608X09L]
C60  4.7uF  [CAPC2012X09N]
D1  (no value)  [DIOM2717X10N]
J11  (no value)  [M3 Spade Hole]
J12  (no value)  [M3 Spade Hole]
J13  (no value)  [M3 Spade Hole]
J14  1704936  [1704936]  (value not drawn)
L2  22uH  [INDC6060X28N]
NT2  0.25mm  [NetTie_0.25mm]  (value not drawn)  (net tie, no BOM)
NT3  0.25mm  [NetTie_0.25mm]  (value not drawn)  (net tie, no BOM)
NT8  0.25mm  [NetTie_0.25mm]  (value not drawn)  (net tie, no BOM)
NT9  0.25mm  [NetTie_0.25mm]  (value not drawn)  (net tie, no BOM)
Q1  (no value)  [SO8FL]
Q2  FILL_FOOTPRINT  [SO8FL_FILL]  (value not drawn)
Q3  (no value)  [SO8FL]
Q4  FILL_FOOTPRINT  [SO8FL_FILL]  (value not drawn)
Q5  (no value)  [SO8FL]
Q6  FILL_FOOTPRINT  [SO8FL_FILL]  (value not drawn)
Q7  (no value)  [SO8FL]
Q8  (no value)  [SO8FL]
Q9  (no value)  [SO8FL]
Q10  (no value)  [SO8FL]
Q11  (no value)  [SO8FL]
Q12  (no value)  [SO8FL]
R12  10k  [RESC1005X40N]
R13  3.3k  [RESC1608X55N]
R14  47K  [RESC1608X55N]
R15  220k  [RESC1608X55N]
R16  18k  [RESC1608X55N]
R17  2.2R  [RESC1608X55N]
R18  2.2R  [RESC1608X55N]
R19  2.2R  [RESC1608X55N]
R20  3.3k  [RESC1608X55N]
R21  18k  [RESC1608X55N]
R22  2.2R  [RESC1608X55N]
R23  2.2R  [RESC1608X55N]
R24  2.2R  [RESC1608X55N]
R25  120R  [RESC1608X55N]
R26  22R  [RESC1608X55N]
R27  500uOhm  [RESC6432X09N]
R28  500uOhm  [RESC6432X09N]
R29  22R  [RESC1608X55N]
R30  120R  [RESC1608X55N]
TP6  TESTPOINT  [TP-R30]  (value not drawn)  (no BOM)
TP7  TESTPOINT  [TP-R30]  (value not drawn)  (no BOM)
U4  (no value)  [TSSOP50P810X120_HS-57N]

### Ports
AH, AL, BH, BL, CH, CL, DC_CAL, EN_GATE, nFAULT, nOCTW, nSCS, SCLK, SDI, SDO, SO1, SO2, TEMP

### Nets
5V: C29.1 L2.2 R16.1
AGND: C23.1 C35.1 C37.1 C38.2 C39.2 R13.2 U4.28(AGND)
AVCC: R12.2 U4.24(REF)
DCBUS: C25.1 C26.2 C40.2 C41.1 C60.2 Q1.D Q2.D Q3.D Q4.D Q5.D Q6.D U4.29(PVDD1) U4.53(PVDD2) U4.54(PVDD2)
GND: C24.2 C25.2 C27.2 C29.2 C32.1 C41.2 C60.1 D1.A R15.2 R20.2 R21.2 U4.57(GND_(PowerPAD))
GVDD: C32.2 U4.13(GVDD)
PGND: C26.1 C40.1 NT2.2 NT3.2 Q7.S Q8.S R27.1 R28.1 U4.44(SL_A)  [also labelled SL_A]
VCC: U4.49(VDD_SPI)
EN_GATE: U4.16(EN_GATE) ; port EN_GATE
GH_A: R17.2 U4.47(GH_A)  [project net GH_A_2]
GH_B: R18.2 U4.42(GH_B)  [project net GH_B_2]
GH_C: R19.2 U4.37(GH_C)  [project net GH_C_2]
GL_A: R22.2 U4.45(GL_A)  [project net GL_A_2]
GL_B: R23.2 U4.40(GL_B)  [project net GL_B_2]
GL_C: R24.2 U4.35(GL_C)  [project net GL_C_2]
M0_AH: U4.17(INH_A) ; port AH
M0_AL: U4.18(INL_A) ; port AL
M0_BH: U4.19(INH_B) ; port BH
M0_BL: U4.20(INL_B) ; port BL
M0_CH: U4.21(INH_C) ; port CH
M0_CL: U4.22(INL_C) ; port CL
M0_nCS: U4.8(nSCS) ; port nSCS
M0_SO1: C38.1 R26.2 TP6.1 ; port SO1
M0_SO2: C39.1 R29.2 TP7.1 ; port SO2
M0_TEMP: C23.2 R12.1 R13.1 ; port TEMP
nFAULT: U4.6(nFAULT) ; port nFAULT
SH_A: C30.1 J11.1 J14.3 Q1.S Q2.S Q7.D Q8.D U4.46(SH_A)  [project net SH_A_2]
SH_B: C31.1 J12.1 J14.2 Q3.S Q4.S Q9.D Q10.D U4.41(SH_B)  [project net SH_B_2]
SH_C: C34.1 J13.1 J14.1 Q5.S Q6.S Q11.D Q12.D U4.36(SH_C)  [project net SH_C_2]
SL_B: NT8.2 Q9.S Q10.S R27.2 U4.39(SL_B)  [project net SL_B_2]
SL_C: NT9.2 Q11.S Q12.S R28.2 U4.34(SL_C)  [project net SL_C_2]
SN1: NT8.1 R25.1  [project net SN1_2]
SN2: NT9.1 R30.1  [project net SN2_2]
SP1: C36.2 NT2.1 U4.32(SP1)  [project net SP1_2]
SP2: C42.2 NT3.1 U4.30(SP2)  [project net SP2_2]
SPI_MISO: U4.10(SDO) ; port SDO
SPI_MOSI: U4.9(SDI) ; port SDI
SPI_SCK: U4.11(SCLK) ; port SCLK
NetC24_1: C24.1 R14.1 U4.2(COMP)
NetC27_1: C27.1 R14.2
NetC28_1: C28.1 D1.K L2.1 U4.50(PH) U4.51(PH)
NetC28_2: C28.2 U4.52(BST_BK)
NetC30_2: C30.2 U4.48(BST_A)
NetC31_2: C31.2 U4.43(BST_B)
NetC33_1: C33.1 U4.14(CP1)
NetC33_2: C33.2 U4.15(CP2)
NetC34_2: C34.2 U4.38(BST_C)
NetC35_2: C35.2 U4.23(DVDD)
NetC36_1: C36.1 R25.2 U4.33(SN1)
NetC37_2: C37.2 U4.27(AVDD)
NetC42_1: C42.1 R30.2 U4.31(SN2)
NetQ1_G: Q1.G Q2.G R17.1
NetQ3_G: Q3.G Q4.G R18.1
NetQ5_G: Q5.G Q6.G R19.1
NetQ7_G: Q7.G Q8.G R22.1
NetQ9_G: Q9.G Q10.G R23.1
NetQ11_G: Q11.G Q12.G R24.1
NetR15_1: R15.1 U4.1(RT_CLK)
NetR16_2: R16.2 R20.1 U4.3(VSENSE)
NetR21_1: R21.1 U4.7(DTC)
NetR26_1: R26.1 U4.25(SO1)
NetR29_1: R29.1 U4.26(SO2)
NetU4_5: U4.5(nOCTW) ; port nOCTW
NetU4_12: U4.12(DC_CAL) ; port DC_CAL

Not connected (* = marked no-connect by the designer): U4 4(PWRGD) 55(EN_BUCK) 56(SS_TR)

### Notes on the sheet
- MOSFETS: NTMFS4935NT1G
- (in symbol NetTie_0.25mm) Net Tie

### Library data of the parts
C23 C32 C35 C37 = GRM188R61C225KE15D: as C1 on sheet Top; Supplier 1: Digi-Key; Supplier Part Number 1: 490-3296-1-ND; Manufacturer Part Number: GRM188R61C225KE15D; RoHS: RoHS Compliant; Category: Capacitors; Stock 1: 1255740; Pricing 1: 1=0.12, 10=0.08, 50=0.046, 100=0.038, 250=0.032, 500=0.0268, 1000=0.022 (USD); Packaging: Cut Tape (CT); Capacitance: 2.2µF; Voltage - Rated: 16V; Temperature Coefficient: X5R; Mounting Type: Surface Mount, MLCC; Operating Temperature: -55°C ~ 85°C; Applications: General Purpose; Ratings: -; Package / Case: 0603 (1608 Metric); Size / Dimension: 0.063" L x 0.031" W (1.60mm x 0.80mm); Height - Seated (Max): -; Thickness (Max): 0.035" (0.90mm); Lead Spacing: -; Features: -; Lead Style: -; ComponentLink1URL: http://www.murata.com/~/media/webrenewal/support/library/catalog/products/capacitor/mlcc/c02e.pdf; ComponentLink1Description: http://www.murata.com/~/media/webrenewal/support/library/catalog/products/capacitor/mlcc/c02e.pdf
C24 = GRM1885C2A820JA01D: CAP CER 82PF 100V NP0 0603; Manufacturer: Murata Electronics North America; Tolerance: ?%; Temperature Coefficient: C0G, NP0; Supplier 1: Digi-Key; Supplier Part Number 1: 490-1349-1-ND; Manufacturer Part Number: GRM1885C2A820JA01D; RoHS: RoHS Compliant; Category: Capacitors; Stock 1: 58970; Pricing 1: 1=0.1, 10=0.052, 50=0.028, 100=0.0237, 250=0.01936, 500=0.01656, 1000=0.0129 (USD); Packaging: Cut Tape (CT); Capacitance: 82pF; Voltage - Rated: 100V; Mounting Type: Surface Mount, MLCC; Operating Temperature: -55°C ~ 125°C; Applications: General Purpose; Ratings: -; Package / Case: 0603 (1608 Metric); Size / Dimension: 0.063" L x 0.031" W (1.60mm x 0.80mm); Height - Seated (Max): -; Thickness (Max): 0.035" (0.90mm); Lead Spacing: -; Features: -; Lead Style: -; ComponentLink1URL: http://www.murata.com/~/media/webrenewal/support/library/catalog/products/capacitor/mlcc/c02e.pdf; ComponentLink1Description: http://www.murata.com/~/media/webrenewal/support/library/catalog/products/capacitor/mlcc/c02e.pdf
C25 C28 C30 C31 C34 C41 = GRM188R71H104KA93D: as C6 on sheet Top; Supplier 1: Digi-Key; Supplier Part Number 1: 490-1519-2-ND; Manufacturer Part Number: GRM188R71H104KA93D; RoHS: RoHS Compliant; Category: Capacitors; Pricing 1: 4000=0.01822, 8000=0.01663, 12000=0.01584 (USD); Packaging: Tape & Reel (TR); Capacitance: 0.1uF; Voltage - Rated: 50V; Temperature Coefficient: X7R; Mounting Type: Surface Mount, MLCC; Operating Temperature: -55°C ~ 125°C; Applications: General Purpose; Ratings: -; Package / Case: 0603 (1608 Metric); Size / Dimension: 0.063" L x 0.032" W (1.60mm x 0.80mm); Height - Seated (Max): -; Thickness (Max): 0.035" (0.90mm); Lead Spacing: -; Features: -; Lead Style: -; ComponentLink1URL: http://www.murata.com/~/media/webrenewal/support/library/catalog/products/capacitor/mlcc/c02e.ashx?la=en-us; ComponentLink1Description: http://www.murata.com/~/media/webrenewal/support/library/catalog/products/capacitor/mlcc/c02e.ashx?la=en-us; Stock: 19812000; Part Status: Active; Supplier 2: Digi-Key; Supplier Part Number 2: 490-1519-1-ND; Pricing 2: 1=0.12, 10=0.084, 100=0.0396, 500=0.02778, 1000=0.023 (USD)
C26 C40 C60 = GRM219R6YA475KA73D: as C19 on sheet Top; Supplier 1: Digi-Key; Supplier Part Number 1: 490-7208-2-ND; RoHS: RoHS Compliant; Category: Capacitors; Pricing 1: 4000=0.05126, 8000=0.0487, 12000=0.04613 (USD); Packaging: Tape & Reel (TR); Part Status: Active; Voltage - Rated: 35V; Temperature Coefficient: X5R; Operating Temperature: -55°C ~ 85°C; Features: Derating Recommended; Ratings: -; Applications: General Purpose; Mounting Type: Surface Mount, MLCC; Package / Case: 0805 (2012 Metric); Size / Dimension: 0.079" L x 0.049" W (2.01mm x 1.25mm); Height - Seated (Max): -; Thickness (Max): 0.037" (0.95mm); Lead Spacing: -; Lead Style: -; ComponentLink1URL: http://www.murata.com/~/media/webrenewal/support/library/catalog/products/capacitor/mlcc/c02e.ashx?la=en-us; ComponentLink1Description: http://www.murata.com/~/media/webrenewal/support/library/catalog/products/capacitor/mlcc/c02e.ashx?la=en-us; Supplier 2: Digi-Key; Supplier Part Number 2: 490-7208-1-ND; Pricing 2: 1=0.26, 10=0.177, 100=0.1002, 500=0.07076, 1000=0.06191 (USD); Value: 4.7uF; Stock: 152000; Manufacturer Part Number: GRM219R6YA475KA73D
C27 = GRM1885C1H271JA01D: CAP CER 270PF 50V NP0 0603; Manufacturer: Murata Electronics North America; Tolerance: ?%; Temperature Coefficient: C0G, NP0; Supplier 1: Digi-Key; Supplier Part Number 1: 490-1437-1-ND; Manufacturer Part Number: GRM1885C1H271JA01D; RoHS: RoHS Compliant; Category: Capacitors; Stock 1: 46048; Pricing 1: 1=0.1, 10=0.048, 50=0.026, 100=0.022, 250=0.018, 500=0.0154, 1000=0.012 (USD); Packaging: Cut Tape (CT); Capacitance: 270pF; Voltage - Rated: 50V; Mounting Type: Surface Mount, MLCC; Operating Temperature: -55°C ~ 125°C; Applications: General Purpose; Ratings: -; Package / Case: 0603 (1608 Metric); Size / Dimension: 0.063" L x 0.031" W (1.60mm x 0.80mm); Height - Seated (Max): -; Thickness (Max): 0.035" (0.90mm); Lead Spacing: -; Features: -; Lead Style: -; ComponentLink1URL: http://www.murata.com/~/media/webrenewal/support/library/catalog/products/capacitor/mlcc/c02e.pdf; ComponentLink1Description: http://www.murata.com/~/media/webrenewal/support/library/catalog/products/capacitor/mlcc/c02e.pdf
C29 = T495C686M016ATE250: CAP TANT 68UF 16V 20% 2312 250mOhm; Manufacturer: KEMET; Manufacturer Size Code: C; Tolerance: ?0%; Type: Molded; Lifetime @ Temp.: 2000 Hrs @ 85°C; Value: 68uF; Supplier 1: Digi-Key; Supplier Part Number 1: 399-10452-1-ND; RoHS: RoHS Compliant; Category: Capacitors; Stock: 39507; Pricing 1: 1=0.98, 10=0.747, 100=0.5345 (USD); Packaging: Cut Tape (CT); Part Status: Active; ESR (Equivalent Series Resistance): 250 mOhm; Operating Temperature: -55°C ~ 125°C; Mounting Type: Surface Mount; Package / Case: 2312 (6032 Metric); Size / Dimension: 0.236" L x 0.126" W (6.00mm x 3.20mm); Height - Seated (Max): 0.110" (2.80mm); Lead Spacing: -; Features: General Purpose; Failure Rate: -; ComponentLink1URL: https://search.kemet.com/component-edge/download/datasheet/T495C686M016ATE250.pdf; ComponentLink1Description: https://search.kemet.com/component-edge/download/datasheet/T495C686M016ATE250.pdf; Supplier 2: Digi-Key; Supplier Part Number 2: 399-10452-2-ND; Pricing 2: 500=0.35986, 1000=0.30988, 2500=0.28988, 5000=0.27608 (USD); Manufacturer Part Number: T495C686M016ATE250
C33 = GRM188R71H223KA01D: CAP CER 0.022UF 50V X7R 0603; Manufacturer: Murata Electronics North America; Tolerance: ?0%; Supplier 1: Digi-Key; Supplier Part Number 1: 490-1517-2-ND; Manufacturer Part Number: GRM188R71H223KA01D; RoHS: RoHS Compliant; Category: Capacitors; Pricing 1: 4000=0.01518, 8000=0.01386, 12000=0.0132 (USD); Packaging: Tape & Reel (TR); Capacitance: 0.022µF; Voltage - Rated: 50V; Temperature Coefficient: X7R; Mounting Type: Surface Mount, MLCC; Operating Temperature: -55°C ~ 125°C; Applications: General Purpose; Ratings: -; Package / Case: 0603 (1608 Metric); Size / Dimension: 0.063" L x 0.032" W (1.60mm x 0.80mm); Height - Seated (Max): -; Thickness (Max): 0.035" (0.90mm); Lead Spacing: -; Features: -; Lead Style: -; ComponentLink1URL: http://search.murata.co.jp/Ceramy/image/img/A01X/G101/ENG/GRM188R71H223KA01-01.pdf; ComponentLink1Description: http://search.murata.co.jp/Ceramy/image/img/A01X/G101/ENG/GRM188R71H223KA01-01.pdf; Stock: 608000; Part Status: Active; Supplier 2: Digi-Key; Supplier Part Number 2: 490-1517-1-ND; Pricing 2: 1=0.11, 10=0.083, 100=0.0372, 500=0.02656, 1000=0.02087 (USD)
C36 C38 C39 C42 = GRM1885C1H222JA01D: CAP CER 2200PF 50V NP0 0603; Manufacturer: Murata Electronics North America; Tolerance: ?%; Temperature Coefficient: C0G, NP0; Supplier 1: Digi-Key; Supplier Part Number 1: 490-1459-1-ND; RoHS: RoHS Compliant; Category: Capacitors; Stock 1: 850589; Pricing 1: 1=0.11, 10=0.08, 25=0.058, 50=0.0434, 100=0.0355, 250=0.02972, 500=0.02536, 1000=0.01992 (USD); Packaging: Cut Tape (CT); Capacitance: 2200pF; Voltage - Rated: 50V; Mounting Type: Surface Mount, MLCC; Operating Temperature: -55°C ~ 125°C; Applications: General Purpose; Ratings: -; Package / Case: 0603 (1608 Metric); Size / Dimension: 0.063" L x 0.031" W (1.60mm x 0.80mm); Height - Seated (Max): -; Thickness (Max): 0.035" (0.90mm); Lead Spacing: -; Features: -; Lead Style: -; ComponentLink1URL: http://www.murata.com/~/media/webrenewal/support/library/catalog/products/capacitor/mlcc/c02e.ashx; ComponentLink1Description: http://www.murata.com/~/media/webrenewal/support/library/catalog/products/capacitor/mlcc/c02e.ashx; Part Status: Active
D1 = MBR140SFT1G: Rectifier Diode, Single, 40 V, 1 A, SOD-123FL, 2, 550 mV
J11-J13 = M3 Spade Terminal
J14 = 1704936: CONN TERM BLOCK 3POS 7.62MM; Manufacturer: Phoenix Contact; Number of Levels: 1; Positions Per Level: 3; Pitch: 0.300" (7.62mm); Mating Orientation: Horizontal with Board; Current: 30A; Voltage: 300V; Wire Gauge: 10-30 AWG; Wire Termination: Screw - Rising Cage Clamp; Torque - Screw: 0.5-0.6 Nm (4.4-5.3 Lb-In); Screw Thread: M3; Supplier 1: Digi-Key; Supplier Part Number 1: 277-5954-ND; RoHS: RoHS Compliant; Category: Connectors, Interconnects; Stock: 3559; Pricing 1: 1=2.19, 10=2.128, 50=1.989, 100=1.8299, 250=1.69064, 500=1.61108, 1000=1.482 (USD); Packaging: Bulk; Part Status: Active; Mounting Type: Through Hole; Features: Interlocking (Side); Color: Green; Operating Temperature: -; Housing Material: Polyamide (PA), Nylon; Contact Material - Plating: -; Clamp Material - Plating: -; Screw Material - Plating: -; ComponentLink1URL: http://media.digikey.com/PDF/Data%20Sheets/Phoenix%20Contact%20PDFs/1704936.pdf; ComponentLink1Description: http://media.digikey.com/PDF/Data%20Sheets/Phoenix%20Contact%20PDFs/1704936.pdf; Manufacturer Part Number: 1704936
L2 = NR6028T220M: INDUCTOR 22UH 1.4A 175.5 MOHM; Value: 22uH
NT2 NT3 NT8 NT9 = NetTie_0.25mm
Q1-Q12 = NTMFS4935NT1G: MOSFET N-CH 30V 13A SO8FL; Manufacturer: ON Semiconductor; FET Type: N-Channel; Current - Continuous Drain (Id) @ 25°C: 13A (Ta), 93A (Tc); Drive Voltage (Max Rds On,  Min Rds On): 4.5V, 10V; Vgs(th) (Max) @ Id: 2.2V @ 250µA; Gate Charge (Qg) (Max) @ Vgs: 49.4nC @ 10V; Input Capacitance (Ciss) (Max) @ Vds: 4850pF @ 15V; Vgs (Max): ?0V; Power Dissipation (Max): 930mW (Ta), 48W (Tc); Rds On (Max) @ Id, Vgs: 3.2 mOhm @ 30A, 10V; Supplier 1: Digi-Key; Supplier Part Number 1: NTMFS4935NT1GOSCT-ND; RoHS: RoHS Compliant; Category: Discrete Semiconductor Products; Stock 1: 932; Pricing 1: 1=0.61, 10=0.541, 100=0.4145, 500=0.3277 (USD); Packaging: Cut Tape (CT); Part Status: Active; Technology: MOSFET (Metal Oxide); Drain to Source Voltage (Vdss): 30V; FET Feature: -; Operating Temperature: -55°C ~ 150°C (TJ); Mounting Type: Surface Mount; Supplier Device Package: 5-DFN (5x6) (8-SOFL); Package / Case: 8-PowerTDFN, 5 Leads; ComponentLink1URL: http://www.onsemi.com/pub_link/Collateral/NTMFS4935N-D.PDF; ComponentLink1Description: http://www.onsemi.com/pub_link/Collateral/NTMFS4935N-D.PDF; Manufacturer Part Number: NTMFS4935NT1G
R12 = NCP15XH103F03RC: THERMISTOR 10K OHM NTC 0402 SMD; Value: 10k
R13 R20 = RC0603FR-073K3L: as R9 on sheet Top; Supplier 1: Digi-Key; Supplier Part Number 1: 311-3.30KHRCT-ND; Manufacturer Part Number: RC0603FR-073K3L; RoHS: RoHS Compliant; Category: Resistors; Stock 1: 420019; Pricing 1: 1=0.1, 10=0.014, 25=0.01, 100=0.0057, 250=0.00436, 500=0.00348, 1000=0.00257, 2500=0.00223 (USD); Packaging: Cut Tape (CT); Resistance (Ohms): 3.3k; Composition: Thick Film; Features: Moisture Resistant; Operating Temperature: -55°C ~ 155°C; Package / Case: 0603 (1608 Metric); Supplier Device Package: 0603; Size / Dimension: 0.063" L x 0.031" W (1.60mm x 0.80mm); Height: 0.022" (0.55mm); Number of Terminations: 2; ComponentLink1URL: http://www.yageo.com/documents/recent/PYu-RC_Group_51_RoHS_L_04.pdf; ComponentLink1Description: http://www.yageo.com/documents/recent/PYu-RC_Group_51_RoHS_L_04.pdf
R14 = RC0603FR-0747KL: as R8 on sheet Top; Supplier 1: Digi-Key; Supplier Part Number 1: 311-47.0KHRCT-ND; Manufacturer Part Number: RC0603FR-0747KL; RoHS: RoHS Compliant; Category: Resistors; Stock 1: 930868; Pricing 1: 1=0.1, 10=0.014, 25=0.01, 100=0.0057, 250=0.00436, 500=0.00348, 1000=0.00257, 2500=0.00223 (USD); Packaging: Cut Tape (CT); Resistance (Ohms): 47k; Composition: Thick Film; Features: Moisture Resistant; Operating Temperature: -55°C ~ 155°C; Package / Case: 0603 (1608 Metric); Supplier Device Package: 0603; Size / Dimension: 0.063" L x 0.031" W (1.60mm x 0.80mm); Height: 0.022" (0.55mm); Number of Terminations: 2; ComponentLink1URL: http://www.yageo.com/documents/recent/PYu-RC_Group_51_RoHS_L_04.pdf; ComponentLink1Description: http://www.yageo.com/documents/recent/PYu-RC_Group_51_RoHS_L_04.pdf
R15 = RC0603FR-07220KL: RES SMD 220K OHM 1% 1/10W 0603; Manufacturer: Yageo; Tolerance: ?%; Power (Watts): 0.1W, 1/10W; Temperature Coefficient: ?00ppm/°C; Supplier 1: Digi-Key; Supplier Part Number 1: 311-220KHRCT-ND; Manufacturer Part Number: RC0603FR-07220KL; RoHS: RoHS Compliant; Category: Resistors; Stock 1: 204390; Pricing 1: 1=0.1, 10=0.014, 25=0.01, 100=0.0057, 250=0.00436, 500=0.00348, 1000=0.00257, 2500=0.00223 (USD); Packaging: Cut Tape (CT); Resistance (Ohms): 220k; Composition: Thick Film; Features: Moisture Resistant; Operating Temperature: -55°C ~ 155°C; Package / Case: 0603 (1608 Metric); Supplier Device Package: 0603; Size / Dimension: 0.063" L x 0.031" W (1.60mm x 0.80mm); Height: 0.022" (0.55mm); Number of Terminations: 2; ComponentLink1URL: http://www.yageo.com/documents/recent/PYu-RC_Group_51_RoHS_L_04.pdf; ComponentLink1Description: http://www.yageo.com/documents/recent/PYu-RC_Group_51_RoHS_L_04.pdf
R16 R21 = RC0603FR-0718KL: RES SMD 18K OHM 1% 1/10W 0603; Manufacturer: Yageo; Tolerance: ?%; Power (Watts): 0.1W, 1/10W; Temperature Coefficient: ?00ppm/°C; Supplier 1: Digi-Key; Supplier Part Number 1: 311-18.0KHRCT-ND; Manufacturer Part Number: RC0603FR-0718KL; RoHS: RoHS Compliant; Category: Resistors; Stock 1: 0; Pricing 1: 1=0.1, 10=0.014, 25=0.01, 100=0.0057, 250=0.00436, 500=0.00348, 1000=0.00257, 2500=0.00223 (USD); Packaging: Cut Tape (CT); Resistance (Ohms): 18k; Composition: Thick Film; Features: Moisture Resistant; Operating Temperature: -55°C ~ 155°C; Package / Case: 0603 (1608 Metric); Supplier Device Package: 0603; Size / Dimension: 0.063" L x 0.031" W (1.60mm x 0.80mm); Height: 0.022" (0.55mm); Number of Terminations: 2; ComponentLink1URL: http://www.yageo.com/documents/recent/PYu-RC_Group_51_RoHS_L_04.pdf; ComponentLink1Description: http://www.yageo.com/documents/recent/PYu-RC_Group_51_RoHS_L_04.pdf
R17-R19 R22-R24 = RC0603FR-072R2L: RES SMD 2.2 OHM 1% 1/10W 0603; Manufacturer: Yageo; Resistance (Ohms): 2.2; Tolerance: ?%; Power (Watts): 0.1W, 1/10W; Temperature Coefficient: ?00ppm/°C; Supplier 1: Digi-Key; Supplier Part Number 1: 311-2.2HRCT-ND; Manufacturer Part Number: RC0603FR-072R2L; RoHS: RoHS Compliant; Category: Resistors; Stock 1: 16531; Pricing 1: 1=0.1, 10=0.02, 25=0.0144, 100=0.0082, 250=0.00624, 500=0.00498, 1000=0.00367, 2500=0.00319 (USD); Packaging: Cut Tape (CT); Composition: Thick Film; Features: Moisture Resistant; Operating Temperature: -55°C ~ 155°C; Package / Case: 0603 (1608 Metric); Supplier Device Package: 0603; Size / Dimension: 0.063" L x 0.031" W (1.60mm x 0.80mm); Height: 0.022" (0.55mm); Number of Terminations: 2; ComponentLink1URL: http://www.yageo.com/documents/recent/PYu-RC_Group_51_RoHS_L_04.pdf; ComponentLink1Description: http://www.yageo.com/documents/recent/PYu-RC_Group_51_RoHS_L_04.pdf
R25 R30 = RC0603FR-07120RL: as R5 on sheet Top; Supplier 1: Digi-Key; Supplier Part Number 1: 311-120HRCT-ND; Manufacturer Part Number: RC0603FR-07120RL; RoHS: RoHS Compliant; Category: Resistors; Stock 1: 1545282; Pricing 1: 1=0.1, 10=0.014, 25=0.01, 100=0.0057, 250=0.00436, 500=0.00348, 1000=0.00257, 2500=0.00223 (USD); Packaging: Cut Tape (CT); Composition: Thick Film; Features: Moisture Resistant; Operating Temperature: -55°C ~ 155°C; Package / Case: 0603 (1608 Metric); Supplier Device Package: 0603; Size / Dimension: 0.063" L x 0.031" W (1.60mm x 0.80mm); Height: 0.022" (0.55mm); Number of Terminations: 2; ComponentLink1URL: http://www.yageo.com/documents/recent/PYu-RC_Group_51_RoHS_L_04.pdf; ComponentLink1Description: http://www.yageo.com/documents/recent/PYu-RC_Group_51_RoHS_L_04.pdf
R26 R29 = RC0603FR-0722RL: as R1 on sheet Top; Supplier 1: Digi-Key; Supplier Part Number 1: 311-22.0HRCT-ND; Manufacturer Part Number: RC0603FR-0722RL; RoHS: RoHS Compliant; Category: Resistors; Stock 1: 575303; Pricing 1: 1=0.1, 10=0.014, 25=0.01, 100=0.0057, 250=0.00436, 500=0.00348, 1000=0.00257, 2500=0.00223 (USD); Packaging: Cut Tape (CT); Composition: Thick Film; Features: Moisture Resistant; Operating Temperature: -55°C ~ 155°C; Package / Case: 0603 (1608 Metric); Supplier Device Package: 0603; Size / Dimension: 0.063" L x 0.031" W (1.60mm x 0.80mm); Height: 0.022" (0.55mm); Number of Terminations: 2; ComponentLink1URL: http://www.yageo.com/documents/recent/PYu-RC_Group_51_RoHS_L_04.pdf; ComponentLink1Description: http://www.yageo.com/documents/recent/PYu-RC_Group_51_RoHS_L_04.pdf
R27 R28 = CSR2512C0R0005F: RES SMD 0.0005 OHM 1% 3W 2512; Manufacturer: Riedon; Tolerance: ?%; Temperature Coefficient: ?00ppm/°C; Value: 500uOhm; Supplier 1: Digi-Key; Supplier Part Number 1: 696-1183-2-ND; RoHS: RoHS Compliant; Category: Resistors; Stock: 2000; Pricing 1: 2000=0.19817, 6000=0.1937, 10000=0.187, 50000=0.18148 (USD); Packaging: Tape & Reel (TR); Part Status: Active; Power (Watts): 3W; Composition: Metal Element; Features: Current Sense; Operating Temperature: -55°C ~ 170°C; Package / Case: 2512 (6432 Metric); Supplier Device Package: 2512; Size / Dimension: 0.250" L x 0.118" W (6.35mm x 3.00mm); Height - Seated (Max): 0.057" (1.45mm); Failure Rate: -; ComponentLink1URL: http://riedon.com/media/pdf/CSR.pdf; ComponentLink1Description: http://riedon.com/media/pdf/CSR.pdf; Supplier 2: Digi-Key; Supplier Part Number 2: 696-1183-1-ND; Pricing 2: 1=0.69, 10=0.574, 25=0.4916, 50=0.4426, 100=0.3852, 250=0.3442, 500=0.27864, 1000=0.22536 (USD); Manufacturer Part Number: CSR2512C0R0005F
TP6 TP7 = TESTPOINT: SMD test pin
U4 = DRV8301: MOTOR DRIVER, 3PH, 56HTSSOP